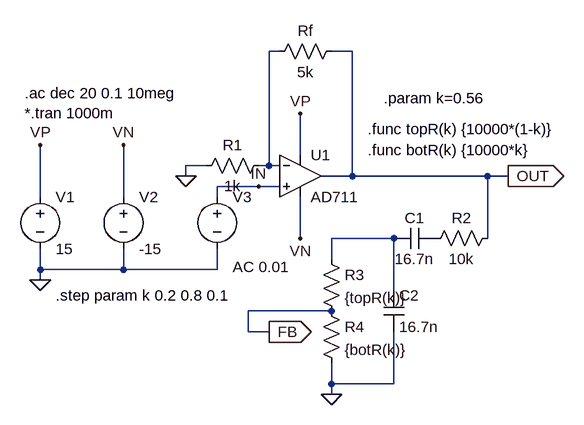
[diagram p0: schematic A2 22.asc]
A2 22.asc, the LTspice schematic file:
Version 4
SHEET 1 880 680
WIRE 128 -16 112 -16
WIRE 240 -16 208 -16
WIRE 160 144 160 80
WIRE 16 160 -16 160
WIRE 112 160 112 -16
WIRE 112 160 96 160
WIRE 128 160 112 160
WIRE -16 176 -16 160
WIRE 240 176 240 -16
WIRE 240 176 192 176
WIRE 448 176 240 176
WIRE 480 176 448 176
WIRE 96 192 32 192
WIRE 128 192 96 192
WIRE -240 208 -240 128
WIRE -112 208 -112 128
WIRE 32 208 32 192
WIRE 160 272 160 208
WIRE 304 272 208 272
WIRE 448 272 448 176
WIRE 208 304 208 272
WIRE -240 320 -240 288
WIRE -112 320 -112 288
WIRE -112 320 -240 320
WIRE 32 320 32 288
WIRE 32 320 -112 320
WIRE -240 336 -240 320
WIRE 304 352 304 272
WIRE 208 384 80 384
WIRE 80 416 80 384
WIRE 112 416 80 416
WIRE 208 496 208 464
WIRE 304 496 304 416
WIRE 304 496 208 496
WIRE 208 512 208 496
FLAG 160 80 VP
FLAG 160 272 VN
FLAG -240 336 0
FLAG -240 128 VP
FLAG -112 128 VN
FLAG 480 176 OUT
IOPIN 480 176 Out
FLAG -16 176 0
FLAG 208 512 0
FLAG 96 192 IN
FLAG 112 416 FB
IOPIN 112 416 Out
SYMBOL OpAmps\\AD711 160 112 R0
SYMATTR InstName U1
SYMBOL voltage -240 192 R0
SYMATTR InstName V1
SYMATTR Value 15
SYMBOL voltage -112 192 R0
SYMATTR InstName V2
SYMATTR Value -15
SYMBOL res 224 -32 R90
WINDOW 0 0 56 VBottom 2
WINDOW 3 32 56 VTop 2
SYMATTR InstName Rf
SYMATTR Value 5k
SYMBOL res 112 144 R90
WINDOW 0 0 56 VBottom 2
WINDOW 3 32 56 VTop 2
SYMATTR InstName R1
SYMATTR Value 1k
SYMBOL res 464 256 R90
WINDOW 0 0 56 VBottom 2
WINDOW 3 32 56 VTop 2
SYMATTR InstName R2
SYMATTR Value 10k
SYMBOL cap 368 256 R90
WINDOW 0 0 32 VBottom 2
WINDOW 3 32 32 VTop 2
SYMATTR InstName C1
SYMATTR Value 16.7n
SYMBOL res 192 288 R0
SYMATTR InstName R3
SYMATTR Value {topR(k)}
SYMBOL res 192 368 R0
SYMATTR InstName R4
SYMATTR Value {botR(k)}
SYMBOL cap 288 352 R0
SYMATTR InstName C2
SYMATTR Value 16.7n
SYMBOL voltage 32 192 R0
WINDOW 123 24 124 Left 2
WINDOW 39 0 0 Left 0
SYMATTR InstName V3
SYMATTR Value ""
SYMATTR Value2 AC 0.01
TEXT -264 48 Left 2 !.ac dec 20 0.1 10meg \n*.tran 1000m
TEXT 288 56 Left 2 !.param k=0.56
TEXT 264 104 Left 2 !.func topR(k) {10000*(1-k)}
TEXT 264 136 Left 2 !.func botR(k) {10000*k}
TEXT -216 360 Left 2 !.step param k 0.2 0.8 0.1

The netlist it stands for:
* A2 22.asc
XU1 IN N001 VP VN OUT AD712  ; AD711, pins In+ In- V+ V- OUT
V1 VP 0 15
V2 VN 0 -15
Rf OUT N001 5k
R1 N001 0 1k
R2 OUT P001 10k
C1 P001 N002 16.7n
R3 N002 FB {topR(k)}
R4 FB 0 {botR(k)}
C2 N002 0 16.7n
V3 IN 0 AC 0.01
.ac dec 20 0.1 10meg
*.tran 1000m
.param k=0.56
.func topR(k) {10000*(1-k)}
.func botR(k) {10000*k}
.step param k 0.2 0.8 0.1
.lib ADI1.lib
.backanno
.end

* Results of the author's LTspice run, read from the files saved beside the schematic
* Operating Point (first step), zero values left out:
*   k = 200 m
*   V(vp) = 15 V
*   V(out) = 125 nV
*   V(vn) = -15 V
*   V(p001) = 125 nV
*   I(Rf) = 25 pA
*   I(V3) = -25 pA
*   I(V2) = 4.899 mA
*   I(V1) = -4.899 mA
*   Ix(u1:1) = 25 pA
*   Ix(u1:2) = 25 pA
*   Ix(u1:3) = 4.899 mA
*   Ix(u1:4) = -4.899 mA
*   Ix(u1:5) = -25 pA
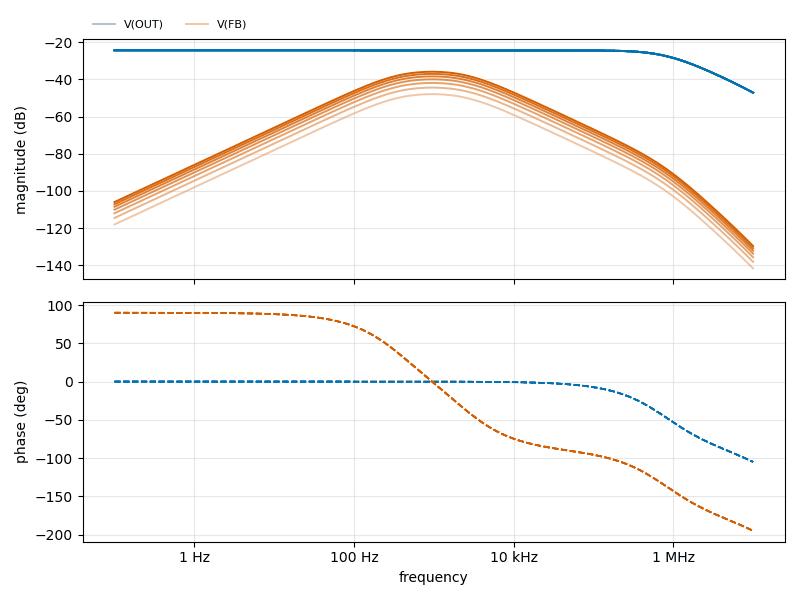
[diagram p1: AC Analysis of A2 22.asc, plotted from the saved traces]
* AC Analysis, 7 runs:
*   V(OUT) [k=0.2]: -24.44 dB at 100 mHz, -47.20 dB at 10 MHz, peak -24.44 dB at 4.467 kHz, 3 dB below the peak at 803.9 kHz
*   V(OUT) [k=0.3]: -24.44 dB at 100 mHz, -47.20 dB at 10 MHz, peak -24.44 dB at 4.467 kHz, 3 dB below the peak at 803.9 kHz
*   V(OUT) [k=0.4]: -24.44 dB at 100 mHz, -47.20 dB at 10 MHz, peak -24.44 dB at 4.467 kHz, 3 dB below the peak at 803.9 kHz
*   V(OUT) [k=0.5]: -24.44 dB at 100 mHz, -47.20 dB at 10 MHz, peak -24.44 dB at 4.467 kHz, 3 dB below the peak at 803.9 kHz
*   V(OUT) [k=0.6]: -24.44 dB at 100 mHz, -47.20 dB at 10 MHz, peak -24.44 dB at 4.467 kHz, 3 dB below the peak at 803.9 kHz
*   V(OUT) [k=0.7]: -24.44 dB at 100 mHz, -47.20 dB at 10 MHz, peak -24.44 dB at 4.467 kHz, 3 dB below the peak at 803.9 kHz
*   V(OUT) [k=0.8]: -24.44 dB at 100 mHz, -47.20 dB at 10 MHz, peak -24.44 dB at 4.467 kHz, 3 dB below the peak at 803.9 kHz
*   V(FB) [k=0.2]: -118.00 dB at 100 mHz, -141.60 dB at 10 MHz, peak -47.96 dB at 1 kHz, 3 dB below the peak at 288.6 Hz and 3.15 kHz
*   V(FB) [k=0.3]: -114.48 dB at 100 mHz, -138.08 dB at 10 MHz, peak -44.44 dB at 1 kHz, 3 dB below the peak at 288.6 Hz and 3.15 kHz
*   V(FB) [k=0.4]: -111.98 dB at 100 mHz, -135.58 dB at 10 MHz, peak -41.94 dB at 1 kHz, 3 dB below the peak at 288.6 Hz and 3.15 kHz
*   V(FB) [k=0.5]: -110.04 dB at 100 mHz, -133.64 dB at 10 MHz, peak -40.00 dB at 1 kHz, 3 dB below the peak at 288.6 Hz and 3.15 kHz
*   V(FB) [k=0.6]: -108.46 dB at 100 mHz, -132.06 dB at 10 MHz, peak -38.42 dB at 1 kHz, 3 dB below the peak at 288.6 Hz and 3.15 kHz
*   V(FB) [k=0.7]: -107.12 dB at 100 mHz, -130.72 dB at 10 MHz, peak -37.08 dB at 1 kHz, 3 dB below the peak at 288.6 Hz and 3.15 kHz
*   V(FB) [k=0.8]: -105.96 dB at 100 mHz, -129.56 dB at 10 MHz, peak -35.92 dB at 1 kHz, 3 dB below the peak at 288.6 Hz and 3.15 kHz